# EAGLE design FSAE_CONTROLLER_DEUTSCH (EAGLE 9.3.0)
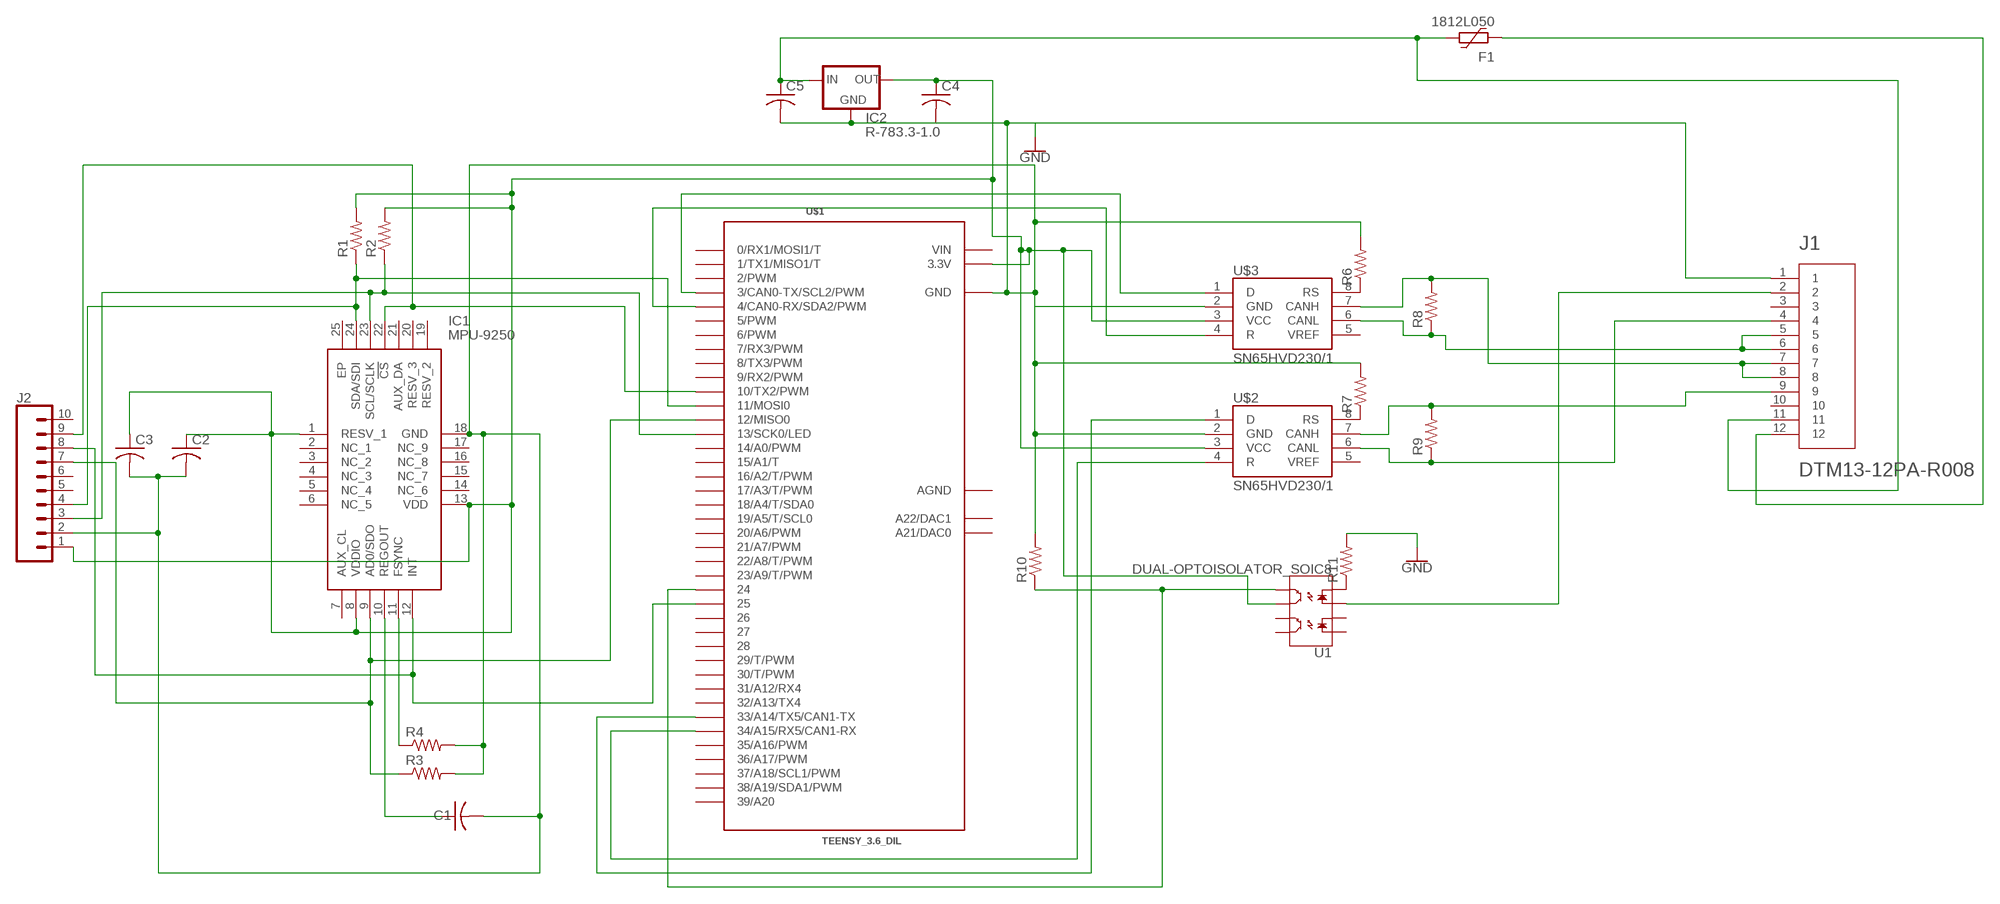
[diagram p0: schematic, sheet 1]

## Parts
C1  C-USC1206  [C1206]
C2  C-USC1206  [C1206]
C3  C-USC1206  [C1206]
C4  C-USC1206  [C1206]
C5  C-USC1206  [C1206]
F1  1812L050  [1812L]
IC1  MPU-9250  [QFN40P300X300X105-25N]
IC2  R-783.3-1.0  [SIP3]
J1  DTM13-12PA-R008  [TE_DTM13-12PA-R008]
J2  CONN_10"  [1X10]
R1  R-US_R1206  [R1206]
R2  R-US_R1206  [R1206]
R3  R-US_R1206  [R1206]
R4  R-US_R1206  [R1206]
R6  R-US_R1206  [R1206]
R7  R-US_R1206  [R1206]
R8  R-US_R1206  [R1206]
R9  R-US_R1206  [R1206]
R10  R-US_R1206  [R1206]
R11  R-US_R1206  [R1206]
U1  DUAL-OPTOISOLATOR_SOIC8  [SO08]
U$1  TEENSY_3.6_DIL  [TEENSY_3.6_DIL]
U$2  SN65HVD230/1  [SO8]
U$3  SN65HVD230/1  [SO8]

## Nets
GND: C1.2 C2.2 C3.2 C4.2 C5.2 IC1.18(GND) IC2.2(GND) J1.1 J2.2 R3.2 R4.2 R6.2 R7.2 R10.2 R11.2 U$1.GND U$1.GND1(GND) U$2.2(GND) U$3.2(GND)
N$1: C5.1 F1.1 IC2.1(IN) J1.11
N$3: IC1.11(FSYNC) R4.1
N$4: C1.1 IC1.10(REGOUT)
N$5: IC1.23(SCL/SCLK) J2.3 R2.1 U$1.13(13/SCK0/LED)
N$6: IC1.24(SDA/SDI) J2.4 R1.1 U$1.11(11/MOSI0)
N$7: IC1.9(AD0/SDO) J2.7 R3.1 U$1.12(12/MISO0)
N$9: IC1.22(!CS) J2.9 U$1.10(10/TX2/PWM)
N$10: R6.1 U$3.8(RS)
N$11: R7.1 U$2.8(RS)
N$12: U$1.3(3/CAN0-TX/SCL2/PWM) U$3.1(D)
N$13: U$1.4(4/CAN0-RX/SDA2/PWM) U$3.4(R)
N$14: J1.9 R9.2 U$2.7(CANH)
N$15: J1.7 J1.8 R8.2 U$3.7(CANH)
N$16: J1.5 J1.6 R8.1 U$3.6(CANL)
N$17: J1.4 R9.1 U$2.6(CANL)
N$18: U$1.33/A14(33/A14/TX5/CAN1-TX) U$2.1(D)
N$19: U$1.34/A15(34/A15/RX5/CAN1-RX) U$2.4(R)
N$20: F1.2 J1.12
N$21: R10.1 U1.5(EM2) U$1.24
N$22: R11.1 U1.4(C2)
N$24: J1.2 U1.3(A2)
N$25: C2.1 C3.1 C4.1 IC1.1(RESV_1) IC1.8(VDDIO) IC1.13(VDD) IC2.3(OUT) J2.1 R1.2 R2.2 U1.6(CL2) U$1.3.3V U$1.3.3V3(3.3V) U$2.3(VCC) U$3.3(VCC)
N$26: IC1.12(INT) J2.8 U$1.25
Unconnected: IC1.2(NC_1) IC1.3(NC_2) IC1.4(NC_3) IC1.5(NC_4) IC1.6(NC_5) IC1.7(AUX_CL) IC1.14(NC_6) IC1.15(NC_7) IC1.16(NC_8) IC1.17(NC_9) IC1.19(RESV_2) IC1.20(RESV_3) IC1.21(AUX_DA) IC1.25(EP) J1.3 J1.10 J2.5 J2.6 J2.10 U1.1(A1) U1.2(C1) U1.7(EM1) U1.8(CL1) U$1.0(0/RX1/MOSI1/T) U$1.1(1/TX1/MISO1/T) U$1.2(2/PWM) U$1.5(5/PWM) U$1.6(6/PWM) U$1.7(7/RX3/PWM) U$1.8(8/TX3/PWM) U$1.9(9/RX2/PWM) U$1.14/A0(14/A0/PWM) U$1.15/A1(15/A1/T) U$1.16/A2(16/A2/T/PWM) U$1.17/A3(17/A3/T/PWM) U$1.18/A4(18/A4/T/SDA0) U$1.19/A5(19/A5/T/SCL0) U$1.20/A6(20/A6/PWM) U$1.21/A7(21/A7/PWM) U$1.22/A8(22/A8/T/PWM) U$1.23/A9(23/A9/T/PWM) U$1.26 U$1.27 U$1.28 U$1.29(29/T/PWM) U$1.30(30/T/PWM) U$1.31/A12(31/A12/RX4) U$1.32/A13(32/A13/TX4) U$1.35/A16(35/A16/PWM) U$1.36/A17(36/A17/PWM) U$1.37/A18(37/A18/SCL1/PWM) U$1.38/A19(38/A19/SDA1/PWM) U$1.39/A20 U$1.A21(A21/DAC0) U$1.A22(A22/DAC1) U$2.5(VREF) U$3.5(VREF)

## Power pins joined to a net without a drawn wire
AGND: U$1.AGND
VIN: U$1.VIN

## Library data of the parts
C1-C5 = rcl:C-US: CAPACITOR, American symbol; SPICEPREFIX: C
F1 = polyfuse-smd_10:?: Polyfuse Resettable PTC Source: http://www.littelfuse.com/products/resettable-ptcs.aspx; MF: Littelfuse; MPN: 1812L050; OC_FARNELL: 1653478; OC_NEWARK: 18M4786
IC1 = Modded Devices:MPU-9250: Multiple Function Sensor Modules Nine-Axis (Gyro + Accelerometer + Compass) MEMS MotionTracking Device Source: Datasheet <https://store.invensense.com/datasheets/invensense/MPU9250REV1.0.pdf>; DESCRIPTION: Multiple Function Sensor Modules Nine-Axis (Gyro + Accelerometer + Compass) MEMS MotionTracking Device; HEIGHT: 1.05mm; MANUFACTURER_NAME: InvenSense Inc.; MANUFACTURER_PART_NUMBER: MPU-9250; MOUSER_PART_NUMBER: 410-MPU-9250; MOUSER_PRICE-STOCK: https://www.mouser.com/Search/Refine.aspx?Keyword=410-MPU-9250; RS_PART_NUMBER: 1774858; RS_PRICE-STOCK: http://uk.rs-online.com/web/p/products/1774858
IC2 = r-78xx_10:R-78*-1.0: Innoline R-78xx-1.0 Series Switching Regulators - 1.0A, Standard Source: http://www.recom-international.com/pdf/Innoline/R-78xx-1.0.pdf; MF: Recom; MPN: R-783.3-1.0; OC_FARNELL: 1793141; OC_NEWARK: 62X9540
J1 = DTM13-12PA-R008:DTM13-12PA-R008: DTM Series, 4.19mm Pitch 12 Way 2 Row Right Angle PCB Header, Solder Termination; AVAILABILITY: Good; DESCRIPTION: DTM Series, 4.19mm Pitch 12 Way 2 Row Right Angle PCB Header, Solder Termination; MF: TE Connectivity; MP: DTM13-12PA-R008; PACKAGE: None; PARTREV: C; PRICE: 18.44 USD; STANDARD: Manufacturer recommendation
J2 = SparkFun-Connectors:CONN_10: Multi connection point. Often used as Generic Header-pin footprint for 0.1 inch spaced/style header connections On any of the 0.1 inch spaced packages, you can populate with these: Break Away Headers - Straight <https://www.sparkfun.com/products/116> (PRT-00116) Break Away Male Headers - Right Angle <https://www.sparkfun.com/products/553> (PRT-00553) Female Headers <https://www.sparkfun.com/products/115> (PRT-00115) Break Away Headers - Machine Pin <https://www.sparkfun.com/products/117> (PRT-00117) Break Away Female Headers - Swiss Machine Pin <https://www.sparkfun.com/products/743> (PRT-00743) Arduino Stackable Header - 10 Pin <https://www.sparkfun.com/products/11376> (PRT-11376) For SCREWTERMINALS and SPRING TERMINALS visit here: Screw Terimnals on SparkFun.com <https://www.sparkfun.com/search/results?term=Screw+Terminals> (5mm/3.5mm/2.54mm spacing) This device is also useful as a general connection point to wire up your design to another part of your project. Our various solder wires solder well into these plated through hole pads. Hook-Up Wire - Assortment (Stranded, 22 AWG) <https://www.sparkfun.com/products/11375> (PRT-11375) Hook-Up Wire - Assortment (Solid Core, 22 AWG) <https://www.sparkfun.com/products/11367> (PRT-11367) View the entire wire category on our website here <https://www.sparkfun.com/categories/141> Special notes: Molex polarized connector foot print use with SKU : PRT-08231 with associated crimp pins and housings. 1MM SMD Version SKU: PRT-10208 NOTES ON THE VARIANTS LOCK and LOCK_LONGPADS... This footprint was designed to help hold the alignment of a through-hole component (i.e. 6-pin header) while soldering it into place. You may notice that each hole has been shifted either up or down by 0.005 of an inch from it's more standard position (which is a perfectly straight line). This slight alteration caused the pins (the squares in the middle) to touch the edges of the holes. Because they are alternating, it causes a "brace" to hold the component in place. 0.005 has proven to be the perfect amount of "off-center" position when using our standard breakaway headers. Although looks a little odd when you look at the bare footprint, once you have a header in there, the alteration is very hard to notice. Also,if you push a header all the way into place, it is covered up entirely on the bottom side.; PROD_ID: CONN-11563
R1-R4 R6-R11 = rcl:R-US_: RESISTOR, American symbol; SPICEPREFIX: R
U1 = SparkFun-DiscreteSemi:DUAL-OPTOISOLATOR: Optocoupler, Phototransistor Output, Dual Channel Optically coupled pairs with a gallium arsenide infrared LED and a silicon NPN phototransistor. Signal information, including a DC level, can be transmitted by the device while maintaining a high degree of electrical isolation between input and output. Datasheet <https://www.sparkfun.com/datasheets/Components/SMD/ild205t.pdf> SparkFun Products: SparkFun Opto-isolator Breakout <https://www.sparkfun.com/products/9118>; PROD_ID: IC-09076
U$1 = Teensy_3_and_LC_Series_Boards_v1.4:TEENSY_3.6_DIL: Teensy 3.6 DIL Package
U$2 U$3 = texas_instruments:SN65HVD230/1

## Board
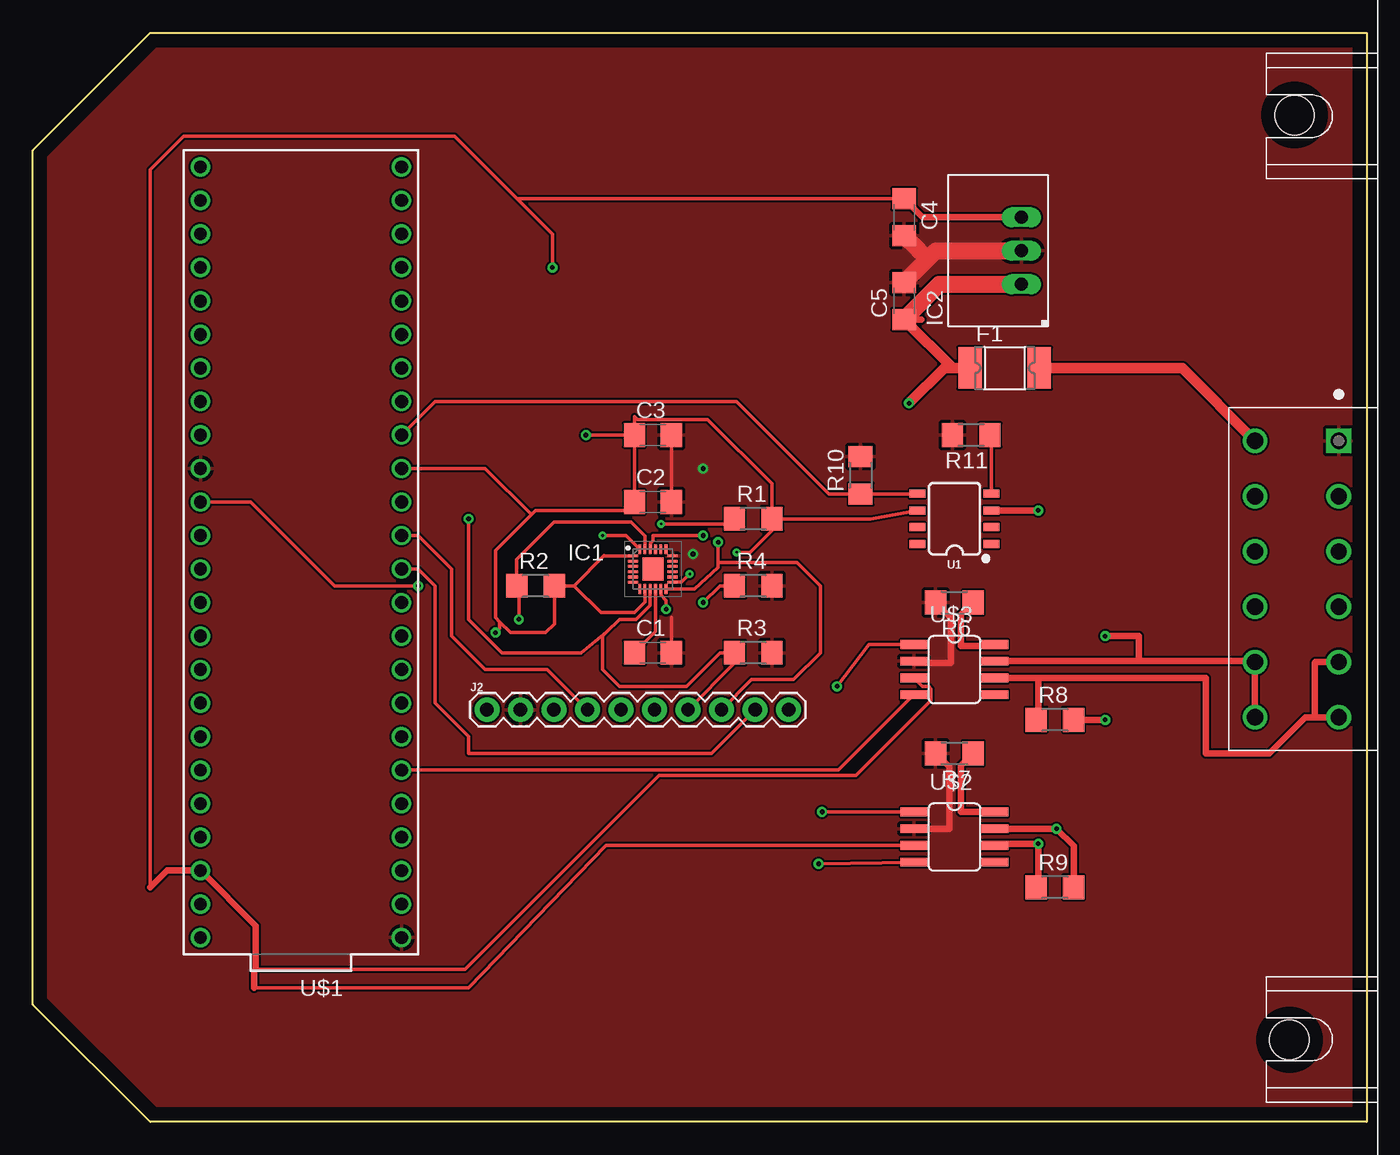
[diagram p1: board, top side]
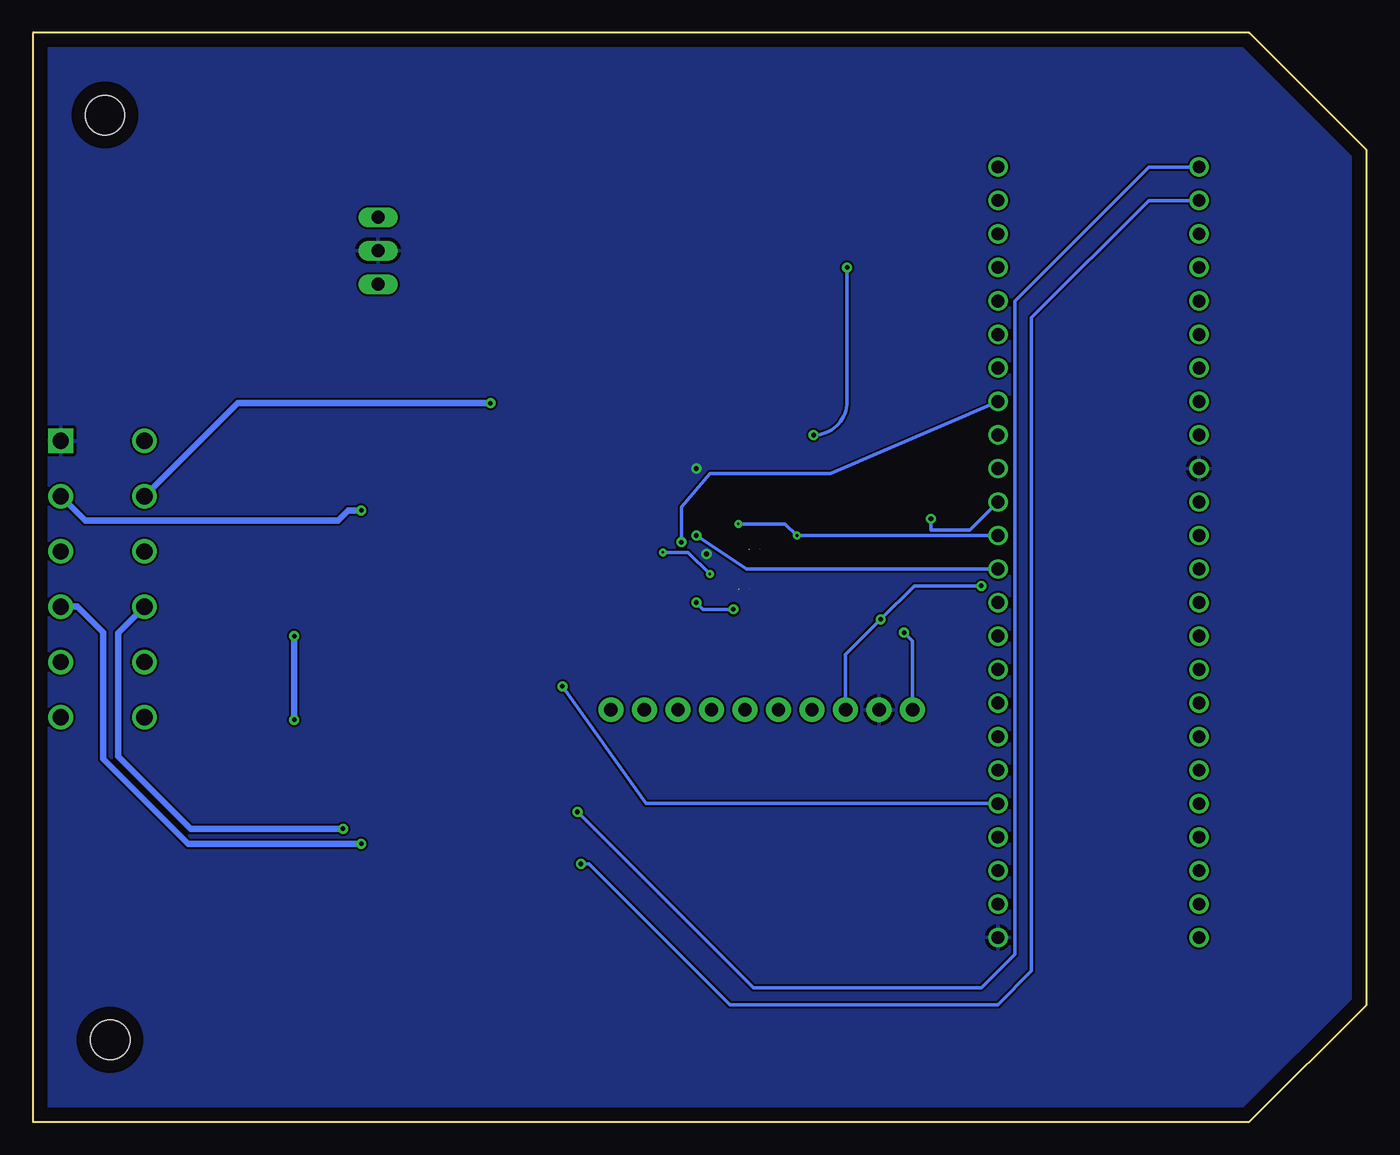
[diagram p2: board, bottom side, seen from below]

Size 101.09 x 82.55 mm. Coordinates in mm from the lower left corner, seen from the top.
Outline: 101.09,0 8.89,0 0,8.89 0,73.66 8.89,82.55 101.09,82.55 101.09,0
Copper layers (1*16): Top 0.035mm / dielectric 1.5mm / Bottom 0.035mm
Design rules "default": minimum track width 6mil, minimum drill 0.35mm, track to track 6mil, track to pad 6mil, pad to pad 6mil, via to via 6mil, smd to smd 6mil, copper to edge 40mil, drill to drill 6mil, minimum pad ring 10mil, minimum via ring 8mil, stop-mask expansion 4mil, vias tented up to drill 0mil, thermal gap 10mil
Holes 3 mm at 95.63,76.33 95.25,6.22

### Footprints (pad centres in the part's own frame; a part is rotated, then mirrored left to right if it is on the bottom)
C1206 = smd 1.6 x 1.8: 1 -1.4,0; 2 1.4,0
1812L = smd 1.78 x 3.15: 1 -2.62,0; 2 2.62,0
QFN40P300X300X105-25N = smd 0.75 x 0.2: 1 -1.5,1; 2 -1.5,0.6; 3 -1.5,0.2; 4 -1.5,-0.2; 5 -1.5,-0.6; 6 -1.5,-1; 13 1.5,-1; 14 1.5,-0.6; 15 1.5,-0.2; 16 1.5,0.2; 17 1.5,0.6; 18 1.5,1 | smd 0.2 x 0.75: 7 -1,-1.5; 8 -0.6,-1.5; 9 -0.2,-1.5; 10 0.2,-1.5; 11 0.6,-1.5; 12 1,-1.5; 19 1,1.5; 20 0.6,1.5; 21 0.2,1.5; 22 -0.2,1.5; 23 -0.6,1.5; 24 -1,1.5 | smd 1.59 x 1.75: 25 0,0
SIP3 = drill 1 long: 1 -2.54,0; 2 0,0; 3 2.54,0
TE_DTM13-12PA-R008 = drill 1.24 square: 1 10.475,-1.96 | drill 1.24: 2 6.285,-1.96; 3 2.095,-1.96; 4 -2.095,-1.96; 5 -6.285,-1.96; 6 -10.475,-1.96; 7 -10.475,4.39; 8 -6.285,4.39; 9 -2.095,4.39; 10 2.095,4.39; 11 6.285,4.39; 12 10.475,4.39
1X10 = drill 1.016 pad 1.88: 1 0,0; 2 2.54,0; 3 5.08,0; 4 7.62,0; 5 10.16,0; 6 12.7,0; 7 15.24,0; 8 17.78,0; 9 20.32,0; 10 22.86,0
R1206 = smd 1.6 x 1.803: 1 -1.422,0; 2 1.422,0
SO08 = smd 0.6 x 1.2: 1 -1.905,-2.8; 2 -0.635,-2.8; 3 0.635,-2.8; 4 1.905,-2.8; 5 1.905,2.8; 6 0.635,2.8; 7 -0.635,2.8; 8 -1.905,2.8
TEENSY_3.6_DIL = drill 0.965: 0 -7.62,25.4; 1 -7.62,22.86; 2 -7.62,20.32; 3 -7.62,17.78; 3.3V 7.62,22.86; 3.3V3 -7.62,-7.62; 4 -7.62,15.24; 5 -7.62,12.7; 6 -7.62,10.16; 7 -7.62,7.62; 8 -7.62,5.08; 9 -7.62,2.54; 10 -7.62,0; 11 -7.62,-2.54; 12 -7.62,-5.08; 13 7.62,-5.08; 14/A0 7.62,-2.54; 15/A1 7.62,0; 16/A2 7.62,2.54; 17/A3 7.62,5.08; 18/A4 7.62,7.62; 19/A5 7.62,10.16; 20/A6 7.62,12.7; 21/A7 7.62,15.24; 22/A8 7.62,17.78; 23/A9 7.62,20.32; 24 -7.62,-10.16; 25 -7.62,-12.7; 26 -7.62,-15.24; 27 -7.62,-17.78; 28 -7.62,-20.32; 29 -7.62,-22.86; 30 -7.62,-25.4; 31/A12 -7.62,-27.94; 32/A13 -7.62,-30.48; 33/A14 7.62,-30.48; 34/A15 7.62,-27.94; 35/A16 7.62,-25.4; 36/A17 7.62,-22.86; 37/A18 7.62,-20.32; 38/A19 7.62,-17.78; 39/A20 7.62,-15.24; A21 7.62,-12.7; A22 7.62,-10.16; AGND 7.62,25.4; GND -7.62,27.94; GND1 7.62,-7.62; VIN 7.62,27.94
SO8 = smd 0.66 x 2.032: 1 -1.905,-3.073; 2 -0.635,-3.073; 3 0.635,-3.073; 4 1.905,-3.073; 5 1.905,3.073; 6 0.635,3.073; 7 -0.635,3.073; 8 -1.905,3.073

### Placement (x,y rotation side)
C1  46.99,35.56 0 top
C2  46.99,46.99 0 top
C3  46.99,52.07 0 top
C4  66.04,68.58 270 top
C5  66.04,62.23 90 top
F1  73.66,57.15 0 top
IC1  46.99,41.91 0 top
IC2  74.93,66.04 90 top
J1  97.03,41.15 90 top
J2  34.42,31.24 0 top
R1  54.61,45.72 0 top
R2  38.1,40.64 0 top
R3  54.61,35.56 0 top
R4  54.61,40.64 0 top
R6  69.85,39.37 180 top
R7  69.85,27.94 180 top
R8  77.47,30.48 0 top
R9  77.47,17.78 0 top
R10  62.74,49.02 90 top
R11  71.12,52.07 180 top
U1  69.85,45.72 90 top
U$1  20.32,41.91 180 top
U$2  69.85,21.59 270 top
U$3  69.85,34.29 270 top

### Tracks (layer width: path | path; a pad name or v marks a point on that pad's centre or on a via)
GND  (via drill 0.35)
  Top 0.254: C1.2 48.39,38.23 | 48.51,42.93 IC1.18 | C3.2 C2.2
  Top 0.508: IC2.2 67.18,66.04 | R6.2 69.6,38.2 69.6,34.8 66.9,34.8 U$3.2 | R7.2 69.47,26.9 69.47,22.23 U$2.2
  Top 1.27: 67.18,66.04 C4.2 | C5.2 68.45,66.04 IC2.2
  other vias: 50.04,43.05 50.8,49.53
  pour Top: 101.09,0 101.09,82.55 8.89,82.55 0,73.66 0,8.89 8.89,0
  pour Bottom: 8.89,82.55 0,73.66 0,8.89 8.89,0 101.09,0 101.09,82.55
N$1  (via drill 0.35)
  Top 0.508: 67.36,60.83 C5.1 66.42,60.45
  Top 0.813: C5.1 69.72,57.15 F1.1 69.09,57.15 v66.42,54.48
  Top 1.27: C5.1 68.71,63.5 IC2.1
  Bottom 0.508: J1.11 85.59,54.48 v66.42,54.48 66.29,54.48
N$3  (via drill 0.35)  (1 unrouted)
  Top 0.254: R4.1 52.07,40.64 v50.8,39.37 50.67,39.24 | v48.01,38.86 48.01,39.52 47.6,39.93 IC1.11
  Bottom 0.254: v50.8,39.37 50.29,38.86 v48.01,38.86
N$4
  Top 0.254: IC1.10 47.19,37.16 C1.1
N$5  (via drill 0.35)
  Top 0.254: IC1.23 46.39,44.41 45.34,45.47 39.5,45.47 36.68,42.65 R2.1 36.83,40.49 v36.83,38.1 | U$1.13 16.51,46.99 22.86,40.64 v29.21,40.64
  Bottom 0.254: v29.21,40.64 34.29,40.64 v36.83,38.1 39.5,35.43 J2.3
N$6  (via drill 0.2)  (1 unrouted)
  Top 0.254: R1.1 52.81,45.34 v47.62,45.34 | v43.18,44.45 44.95,44.45 IC1.24 | J2.4 38.99,34.29 34.29,34.29 31.75,36.83 31.75,41.91 29.21,44.45 U$1.11
  Bottom 0.254: v47.62,45.34 44.07,45.34 v43.18,44.45 U$1.11
N$7  (via drill 0.35)  (1 unrouted)
  Top 0.254: 43.5,37.15 43.18,36.83 43.18,34.29 44.45,33.02 49.53,33.02 52.07,35.56 R3.1 53.19,34.77 J2.7 | 43.5,37.15 44.45,38.1 45.72,38.1 46.78,39.16 IC1.9 | v33.02,45.72 33.02,38.1 35.56,35.56 41.53,35.56 43.5,37.15
  Bottom 0.254: U$1.12 30.07,44.86 33.02,44.86 v33.02,45.72
N$9  (via drill 0.35)  (1 unrouted)
  Top 0.254: v50.8,44.45 46.99,44.45 46.99,44.08 46.8,43.89 IC1.22 | J2.9 51.44,27.94 33.02,27.94 33.02,29.21 30.48,31.75 30.48,40.64 29.21,41.91 U$1.10
  Bottom 0.254: U$1.10 46.99,41.91 v50.8,44.45
N$10
  Top 0.508: R6.1 70.36,38.46 70.36,36.07 72.8,36.07 U$3.8
N$11
  Top 0.508: 70.87,27.53 R7.1 70.36,27.03 70.36,23.5 U$2.8
N$12  (via drill 0.35)
  Top 0.254: v60.96,33.02 63.37,36.2 U$3.1
  Bottom 0.254: U$1.3 54.61,24.13 v60.96,33.02
N$13
  Top 0.254: U$3.4 61.06,26.67 U$1.4
N$14  (via drill 0.35)
  Top 0.508: U$2.7 v77.6,22.23 78.89,20.93 R9.2
  Bottom 0.508: J1.9 94.61,37.08 94.61,27.69 89.15,22.23 v77.6,22.23
N$15  (via drill 0.35)
  Top 0.508: U$3.7 83.82,34.92 | 83.82,34.92 92.58,34.92 J1.8 J1.7 | R8.2 v81.28,30.48 | v81.28,36.83 83.82,36.83 83.82,34.92
  Bottom 0.508: v81.28,30.48 v81.28,36.83
N$16
  Top 0.508: 72.87,33.66 U$3.6 76.2,33.66 | J1.6 99.06,30.6 | 76.2,33.66 88.9,33.66 88.9,27.94 93.73,27.94 96.46,30.67 J1.6 | R8.1 76.2,30.63 76.2,33.66 | J1.5 97.22,34.86 97.16,34.8 97.16,30.73 97.22,30.67 J1.6
N$17  (via drill 0.35)
  Top 0.508: U$2.6 73.05,21.08 v76.2,21.08 76.2,17.93 R9.1
  Bottom 0.508: J1.4 97.73,39.05 95.76,37.08 95.76,27.51 89.33,21.08 v76.2,21.08
N$18  (via drill 0.35)
  Top 0.254: v59.82,23.5 U$2.1
  Bottom 0.254: U$1.33/A14 16.51,72.39 26.67,62.23 26.67,12.7 29.21,10.16 46.48,10.16 v59.82,23.5
N$19  (via drill 0.35)
  Top 0.254: U$2.4 v59.56,19.56
  Bottom 0.254: U$1.34/A15 16.51,69.85 25.4,60.96 25.4,11.43 27.94,8.89 48.26,8.89 58.93,19.56 v59.56,19.56
N$20
  Top 0.813: J1.12 87.11,57.15 F1.2
N$21
  Top 0.254: U1.5 67.03,47.6 R10.1 60.35,47.6 53.34,54.61 30.48,54.61 U$1.24
N$22
  Top 0.254: U1.4 72.65,51.96 R11.1
N$24  (via drill 0.35)
  Top 0.508: U1.3 v76.2,46.35
  Bottom 0.508: J1.2 97.15,45.59 77.98,45.59 77.22,46.35 v76.2,46.35
N$25  (via drill 0.2, 0.35)
  Top 0.254: 41.02,40.64 R2.2 39.52,37.74 38.86,37.08 36.2,37.08 35.37,37.91 | 41.02,40.64 43.31,42.93 43.32,42.91 IC1.1 | 37.78,46.04 38.1,46.35 44.95,46.35 C2.1 C3.1 | 37.78,46.04 35.05,43.31 35.05,38.23 35.37,37.91 | IC1.8 46.39,39.41 45.59,38.61 43.05,38.61 41.02,40.64 | IC1.13 49.16,40.91 v49.78,41.53 | v53.34,43.18 54.36,43.18 56.39,45.21 56.03,45.57 R1.2 | C4.1 36.7,69.98 | 36.7,69.98 31.95,74.73 11.43,74.73 8.89,72.19 8.89,17.78 | R1.2 63.5,45.72 U1.6 | R1.2 56.01,48.39 51.15,53.25 45.81,53.25 45.59,53.47 C3.1 | C3.1 v41.91,52.07 | v39.37,64.77 39.37,67.31 36.7,69.98 | U$2.3 43.43,20.95 33.02,10.16 16.76,10.16 | U$3.3 67.44,32.99 67.91,32.99 68.07,32.83 68.07,31.94 62.4,26.26 47.47,26.26 32.77,11.56 16.89,11.56 | v35.05,37.08 35.37,37.4 35.37,37.91 | 37.78,46.04 34.29,49.53 U$1.3.3V3
  Top 0.508: IC2.3 67.44,68.58 C4.1 | 8.89,17.78 10.16,19.05 U$1.3.3V 16.89,14.86 16.89,11.56 16.76,11.43 16.76,10.16
  Bottom 0.254: v49.78,41.53 51.44,43.18 v53.34,43.18 | v41.91,52.07 arc-90 39.37,54.61 v39.37,64.77 | J2.1 34.42,36.45 v35.05,37.08
N$26  (via drill 0.35)
  Top 0.254: IC1.12 50.16,40.39 51.94,42.04 51.94,42.29 | 51.94,42.29 v51.94,43.94 | J2.8 54.48,33.53 57.66,33.53 59.69,35.56 59.69,40.64 57.91,42.42 52.07,42.42 51.94,42.29
  Bottom 0.254: v51.94,43.94 51.94,46.61 49.78,49.15 40.64,49.15 U$1.25